# Altium schematic sheet Sheet1.SchDoc
size A4
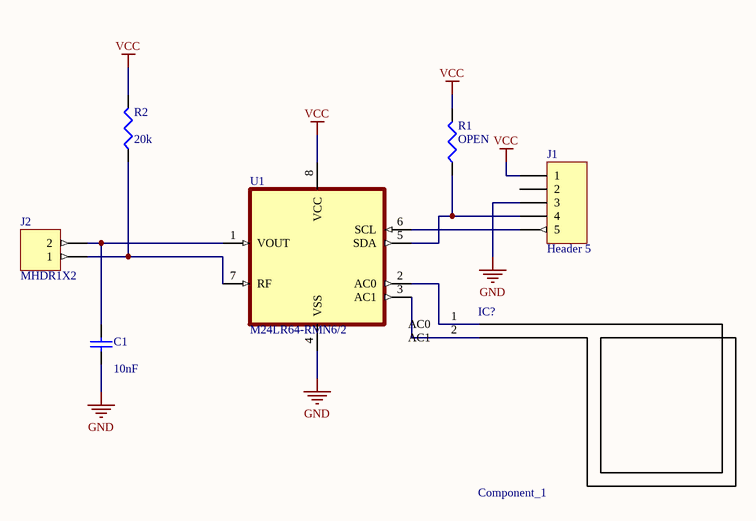
[diagram p0: Sheet1.SchDoc]

## Parts
C1  value 10nF  [RAD-0.3]
IC?  Component_1  [Antena]
J1  Header 5  [HDR1X5]
J2  MHDR1X2  [MHDR1X2]
R1  OPEN  [J1-0603]
R2  value 20k  [J1-0603]
U1  M24LR64-RMN6/2  [SOIC127P600X175-8N]

## Nets
GND: C1.1 J1.3 U1.4(VSS)
VCC: J1.1 R1.2 R2.2 U1.8(VCC)
NetC1_2: C1.2 J2.2 U1.1(VOUT)
NetIC?_1: IC?.1(AC0) U1.2(AC0)
NetIC?_2: IC?.2(AC1) U1.3(AC1)
NetJ1_4: J1.4 R1.1 U1.5(SDA)
NetJ1_5: J1.5 U1.6(SCL)
NetJ2_1: J2.1 R2.1 U1.7(RF)

Not connected (* = marked no-connect by the designer): J1 2

## Library data of the parts
C1 = Cap: Capacitor; Published: 8-Jun-2000; LatestRevisionDate: 17-Jul-2002; LatestRevisionNote: Re-released for DXP Platform.; PackageReference: RAD-0.3; Publisher: Altium Limited; PackageDescription: Radial Cap, Thru-Hole; 2 Leads; 0.3 in Pin Spacing
IC? = Component_1: Antena
J1 = Header 5: Header, 5-Pin; LatestRevisionDate: 17-Jul-2002; LatestRevisionNote: Re-released for DXP Platform.; Publisher: Altium Limited
J2 = MHDR1X2: Header, 2-Pin; LatestRevisionDate: 17-Jul-2002; LatestRevisionNote: Re-released for DXP Platform.; Publisher: Altium Limited
R1 R2 = Res3: Resistor; Published: 8-Jun-2000; LatestRevisionDate: 29-May-2009; LatestRevisionNote: IPC-7351 Footprint Added.; PackageReference: J1-0603; Publisher: Altium Limited; PackageDescription: Chip Resistor
U1 = M24LR64-RMN6/2: 64 Kbit EEPROM; MP: M24LR64-RMN6-2; Package: None; Price: None; Value: *; Availability: Unavailable